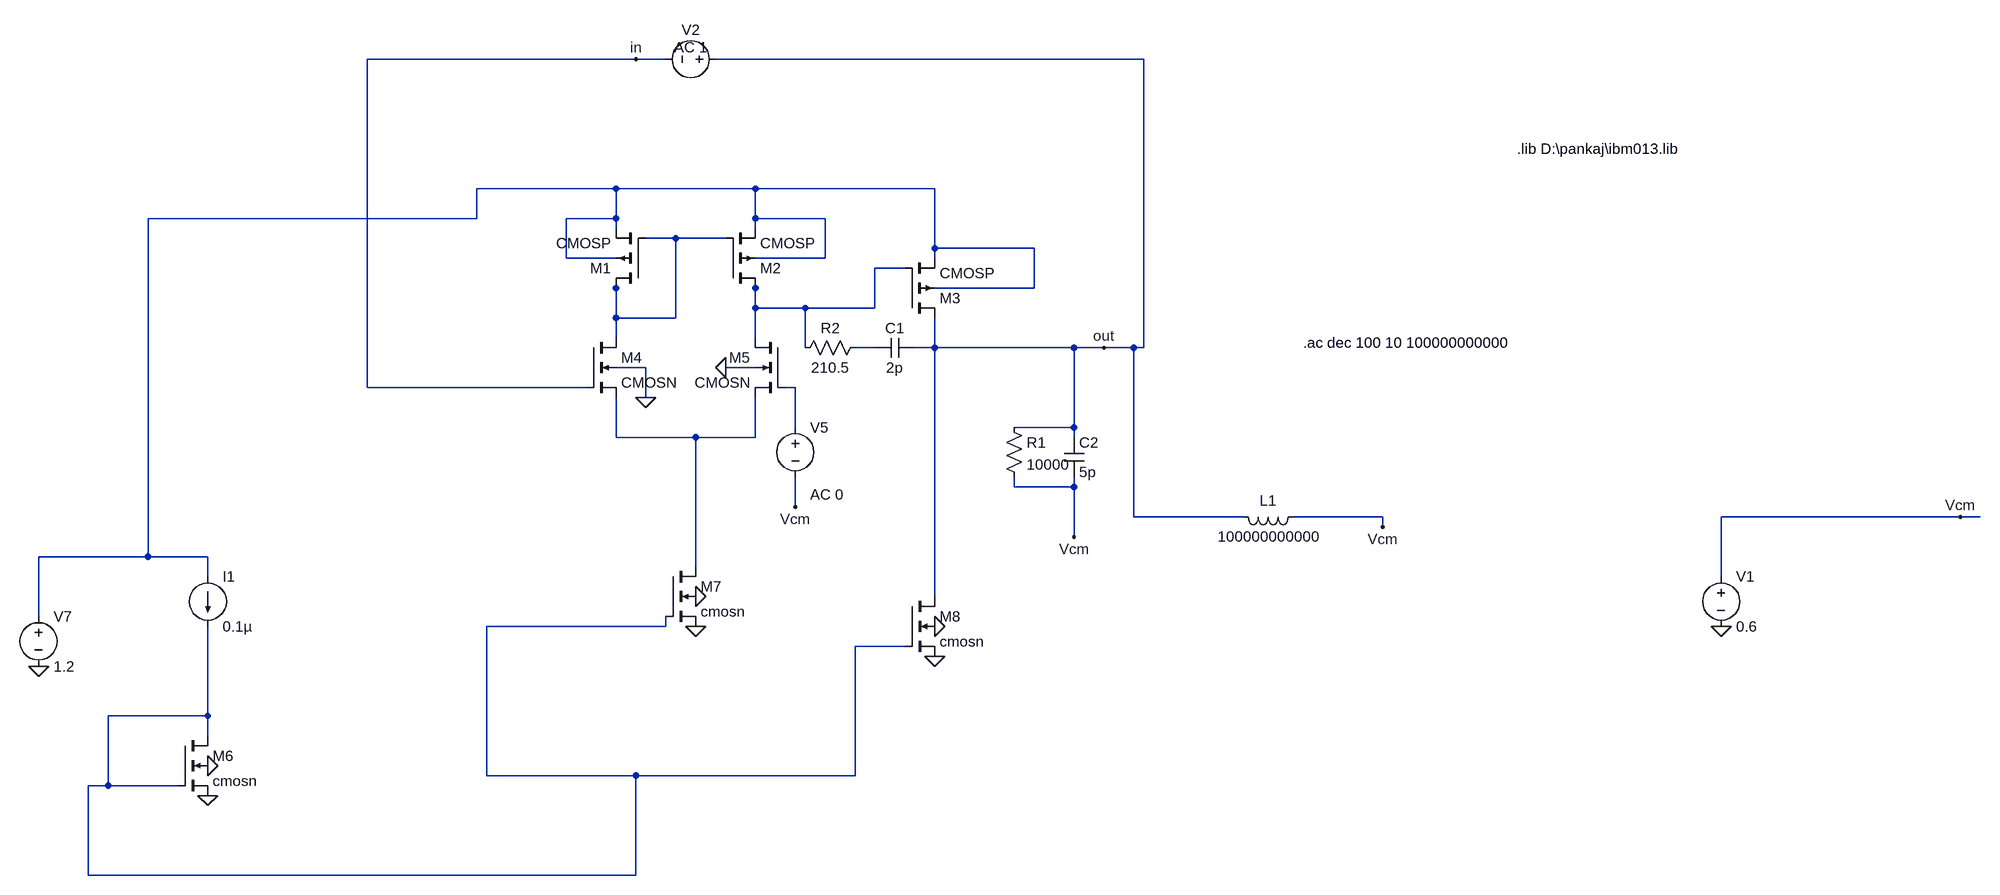
[diagram p0: schematic with bias final open loop.asc]
with bias final open loop.asc, the LTspice schematic file:
Version 4
SHEET 1 2040 1156
WIRE -304 -384 -736 -384
WIRE -256 -384 -304 -384
WIRE 512 -384 -176 -384
WIRE -336 -176 -560 -176
WIRE -112 -176 -336 -176
WIRE 176 -176 -112 -176
WIRE -560 -128 -560 -176
WIRE -560 -128 -1088 -128
WIRE -336 -128 -336 -176
WIRE -336 -128 -416 -128
WIRE -112 -128 -112 -176
WIRE 0 -128 -112 -128
WIRE -336 -112 -336 -128
WIRE -112 -112 -112 -128
WIRE -240 -96 -288 -96
WIRE -160 -96 -240 -96
WIRE 176 -80 176 -176
WIRE 336 -80 176 -80
WIRE -416 -64 -416 -128
WIRE -336 -64 -416 -64
WIRE 0 -64 0 -128
WIRE 0 -64 -112 -64
WIRE 176 -64 176 -80
WIRE 128 -48 80 -48
WIRE -336 -16 -336 -32
WIRE -112 -16 -112 -32
WIRE 336 -16 336 -80
WIRE 336 -16 176 -16
WIRE -112 16 -112 -16
WIRE -32 16 -112 16
WIRE 80 16 80 -48
WIRE 80 16 -32 16
WIRE -336 32 -336 -16
WIRE -240 32 -240 -96
WIRE -240 32 -336 32
WIRE -336 64 -336 32
WIRE -112 64 -112 16
WIRE -32 80 -32 16
WIRE 80 80 48 80
WIRE 176 80 176 32
WIRE 176 80 144 80
WIRE 400 80 176 80
WIRE 448 80 400 80
WIRE 496 80 448 80
WIRE 512 80 512 -384
WIRE 512 80 496 80
WIRE -288 112 -336 112
WIRE -112 112 -160 112
WIRE -736 144 -736 -384
WIRE -384 144 -736 144
WIRE -48 144 -64 144
WIRE -288 160 -288 112
WIRE -48 208 -48 144
WIRE 400 208 400 80
WIRE 400 208 304 208
WIRE -336 224 -336 160
WIRE -208 224 -336 224
WIRE -112 224 -112 160
WIRE -112 224 -208 224
WIRE 400 224 400 208
WIRE 304 304 304 288
WIRE 400 304 400 288
WIRE 400 304 304 304
WIRE -48 336 -48 288
WIRE 496 352 496 80
WIRE 672 352 496 352
WIRE 896 352 752 352
WIRE 1824 352 1440 352
WIRE 1856 352 1824 352
WIRE 896 368 896 352
WIRE 400 384 400 304
WIRE -1088 416 -1088 -128
WIRE -1088 416 -1264 416
WIRE -992 416 -1088 416
WIRE -208 432 -208 224
WIRE -992 448 -992 416
WIRE 1440 448 1440 352
WIRE 176 480 176 80
WIRE -1264 512 -1264 416
WIRE -256 528 -256 512
WIRE -256 528 -544 528
WIRE 128 560 48 560
WIRE -992 672 -992 528
WIRE -992 672 -1152 672
WIRE -992 704 -992 672
WIRE -544 768 -544 528
WIRE -304 768 -544 768
WIRE 48 768 48 560
WIRE 48 768 -304 768
WIRE -1152 784 -1152 672
WIRE -1152 784 -1184 784
WIRE -1040 784 -1152 784
WIRE -1184 928 -1184 784
WIRE -304 928 -304 768
WIRE -304 928 -1184 928
FLAG -304 -384 in
FLAG 448 80 out
FLAG -1264 592 0
FLAG 1440 528 0
FLAG 1824 352 Vcm
FLAG 896 368 Vcm
FLAG 400 384 Vcm
FLAG -48 336 Vcm
FLAG 176 528 0
FLAG 176 576 0
FLAG -208 528 0
FLAG -208 480 0
FLAG -288 160 0
FLAG -160 112 0
FLAG -992 752 0
FLAG -992 800 0
SYMBOL nmos4 -384 64 R0
SYMATTR InstName M4
SYMATTR Value CMOSN
SYMATTR Value2 l=480n w=7.58u
SYMBOL nmos4 -64 64 M0
SYMATTR InstName M5
SYMATTR Value CMOSN
SYMATTR Value2 l=480n w=7.58u
SYMBOL cap 144 64 R90
WINDOW 0 0 32 VBottom 2
WINDOW 3 32 32 VTop 2
SYMATTR InstName C1
SYMATTR Value 2p
SYMBOL current -992 448 R0
WINDOW 123 0 0 Left 0
WINDOW 39 0 0 Left 0
SYMATTR InstName I1
SYMATTR Value 0.1µ
SYMBOL voltage -160 -384 R90
WINDOW 0 -32 56 VBottom 2
WINDOW 3 32 56 VTop 2
WINDOW 123 -4 56 VBottom 2
WINDOW 39 0 0 Left 0
SYMATTR InstName V2
SYMATTR Value ""
SYMATTR Value2 AC 1
SYMBOL res 288 192 R0
SYMATTR InstName R1
SYMATTR Value 10000
SYMBOL cap 384 224 R0
SYMATTR InstName C2
SYMATTR Value 5p
SYMBOL ind 768 336 R90
WINDOW 0 5 56 VBottom 2
WINDOW 3 32 56 VTop 2
SYMATTR InstName L1
SYMATTR Value 100000000000
SYMBOL res 64 64 R90
WINDOW 0 0 56 VBottom 2
WINDOW 3 32 56 VTop 2
SYMATTR InstName R2
SYMATTR Value 210.5
SYMBOL voltage -48 192 R0
WINDOW 123 24 124 Left 2
WINDOW 39 0 0 Left 0
SYMATTR Value2 AC 0
SYMATTR InstName V5
SYMATTR Value ""
SYMBOL nmos4 -256 432 R0
SYMATTR InstName M7
SYMATTR Value cmosn
SYMATTR Value2 l=720n w=151.6u
SYMBOL nmos4 128 480 R0
SYMATTR InstName M8
SYMATTR Value cmosn
SYMATTR Value2 l=720n w=1262u
SYMBOL voltage -1264 496 R0
WINDOW 123 0 0 Left 0
WINDOW 39 0 0 Left 0
SYMATTR InstName V7
SYMATTR Value 1.2
SYMBOL nmos4 -1040 704 R0
SYMATTR InstName M6
SYMATTR Value cmosn
SYMATTR Value2 l=720n w=0.2u
SYMBOL pmos4 -288 -16 R180
SYMATTR InstName M1
SYMATTR Value CMOSP
SYMATTR Value2 l=480n w=7.58u
SYMBOL pmos4 -160 -16 M180
SYMATTR InstName M2
SYMATTR Value CMOSP
SYMATTR Value2 l=480n w=7.58u
SYMBOL pmos4 128 32 M180
SYMATTR InstName M3
SYMATTR Value CMOSP
SYMATTR Value2 l=480n w=126.2u
SYMBOL voltage 1440 432 R0
WINDOW 123 0 0 Left 0
WINDOW 39 0 0 Left 0
SYMATTR InstName V1
SYMATTR Value 0.6
TEXT 768 72 Left 2 !.ac dec 100 10 100000000000
TEXT 1112 -240 Left 2 !.lib D:\\pankaj\\ibm013.lib

The netlist it stands for:
* with bias final open loop.asc
M4 N002 in N006 0 CMOSN l=480n w=7.58u
M5 N003 N005 N006 0 CMOSN l=480n w=7.58u
C1 out N004 2p
I1 N001 N007 0.1µ
V2 out in AC 1
R1 out Vcm 10000
C2 out Vcm 5p
L1 Vcm out 100000000000
R2 N004 N003 210.5
V5 N005 Vcm AC 0
M7 N006 N007 0 0 cmosn l=720n w=151.6u
M8 out N007 0 0 cmosn l=720n w=1262u
V7 N001 0 1.2
M6 N007 N007 0 0 cmosn l=720n w=0.2u
M1 N002 N002 N001 N001 CMOSP l=480n w=7.58u
M2 N003 N002 N001 N001 CMOSP l=480n w=7.58u
M3 out N003 N001 N001 CMOSP l=480n w=126.2u
V1 Vcm 0 0.6
.model NMOS NMOS
.model PMOS PMOS
.lib standard.mos
.ac dec 100 10 100000000000
.lib D:\pankaj\ibm013.lib
.backanno
.end